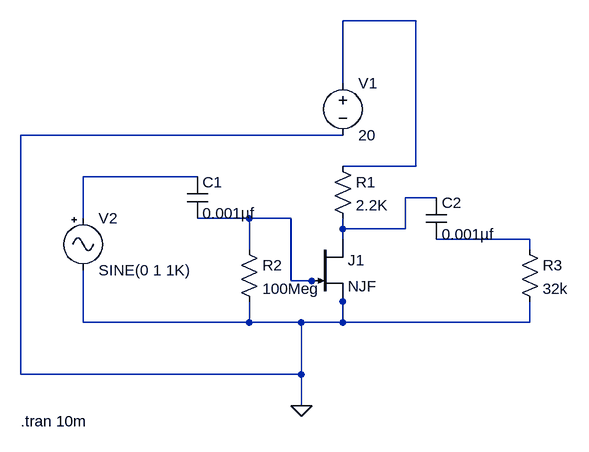
[diagram p0: schematic ECA04 C03 AT2.asc]
ECA04 C03 AT2.asc, the LTspice schematic file:
Version 4.1
SHEET 1 880 680
WIRE -112 -176 -224 -176
WIRE -224 -80 -224 -176
WIRE -224 0 -720 0
WIRE -112 48 -112 -176
WIRE -112 48 -224 48
WIRE -448 64 -624 64
WIRE -80 96 -128 96
WIRE -624 128 -624 64
WIRE -368 128 -448 128
WIRE -304 128 -368 128
WIRE -224 144 -224 128
WIRE -128 144 -128 96
WIRE -128 144 -224 144
WIRE -224 160 -224 144
WIRE 64 160 -80 160
WIRE -368 176 -368 128
WIRE 64 176 64 160
WIRE -304 224 -304 128
WIRE -272 224 -304 224
WIRE -256 224 -272 224
WIRE -224 256 -224 240
WIRE -624 288 -624 208
WIRE -368 288 -368 256
WIRE -368 288 -624 288
WIRE -288 288 -368 288
WIRE -224 288 -224 256
WIRE -224 288 -288 288
WIRE 64 288 64 256
WIRE 64 288 -224 288
WIRE -720 368 -720 0
WIRE -288 368 -288 288
WIRE -288 368 -720 368
WIRE -288 416 -288 368
FLAG -288 416 0
SYMBOL njf -272 160 R0
SYMATTR InstName J1
SYMBOL voltage -224 -96 R0
WINDOW 123 0 0 Left 0
WINDOW 39 0 0 Left 0
SYMATTR InstName V1
SYMATTR Value 20
SYMBOL Misc\\signal -624 112 R0
SYMATTR InstName V2
SYMBOL res -240 32 R0
SYMATTR InstName R1
SYMATTR Value 2.2K
SYMBOL res -384 160 R0
SYMATTR InstName R2
SYMATTR Value 100Meg
SYMBOL res 48 160 R0
SYMATTR InstName R3
SYMATTR Value 32k
SYMBOL cap -464 64 R0
SYMATTR InstName C1
SYMATTR Value 0.001µf
SYMBOL cap -96 96 R0
SYMATTR InstName C2
SYMATTR Value 0.001µf
TEXT -720 440 Left 2 !.tran 10m

The netlist it stands for:
* ECA04 C03 AT2.asc
J1 N003 N004 0 NJF
V1 N001 0 20
V2 N002 0 SINE(0 1 1K)
R1 N001 N003 2.2K
R2 N004 0 100Meg
R3 N005 0 32k
C1 N002 N004 0.001µf
C2 N003 N005 0.001µf
.model NJF NJF
.model PJF PJF
.lib standard.jft
.tran 10m
.backanno
.end